# Altium schematic sheet RobotDriverSCH.SchDoc
size A3
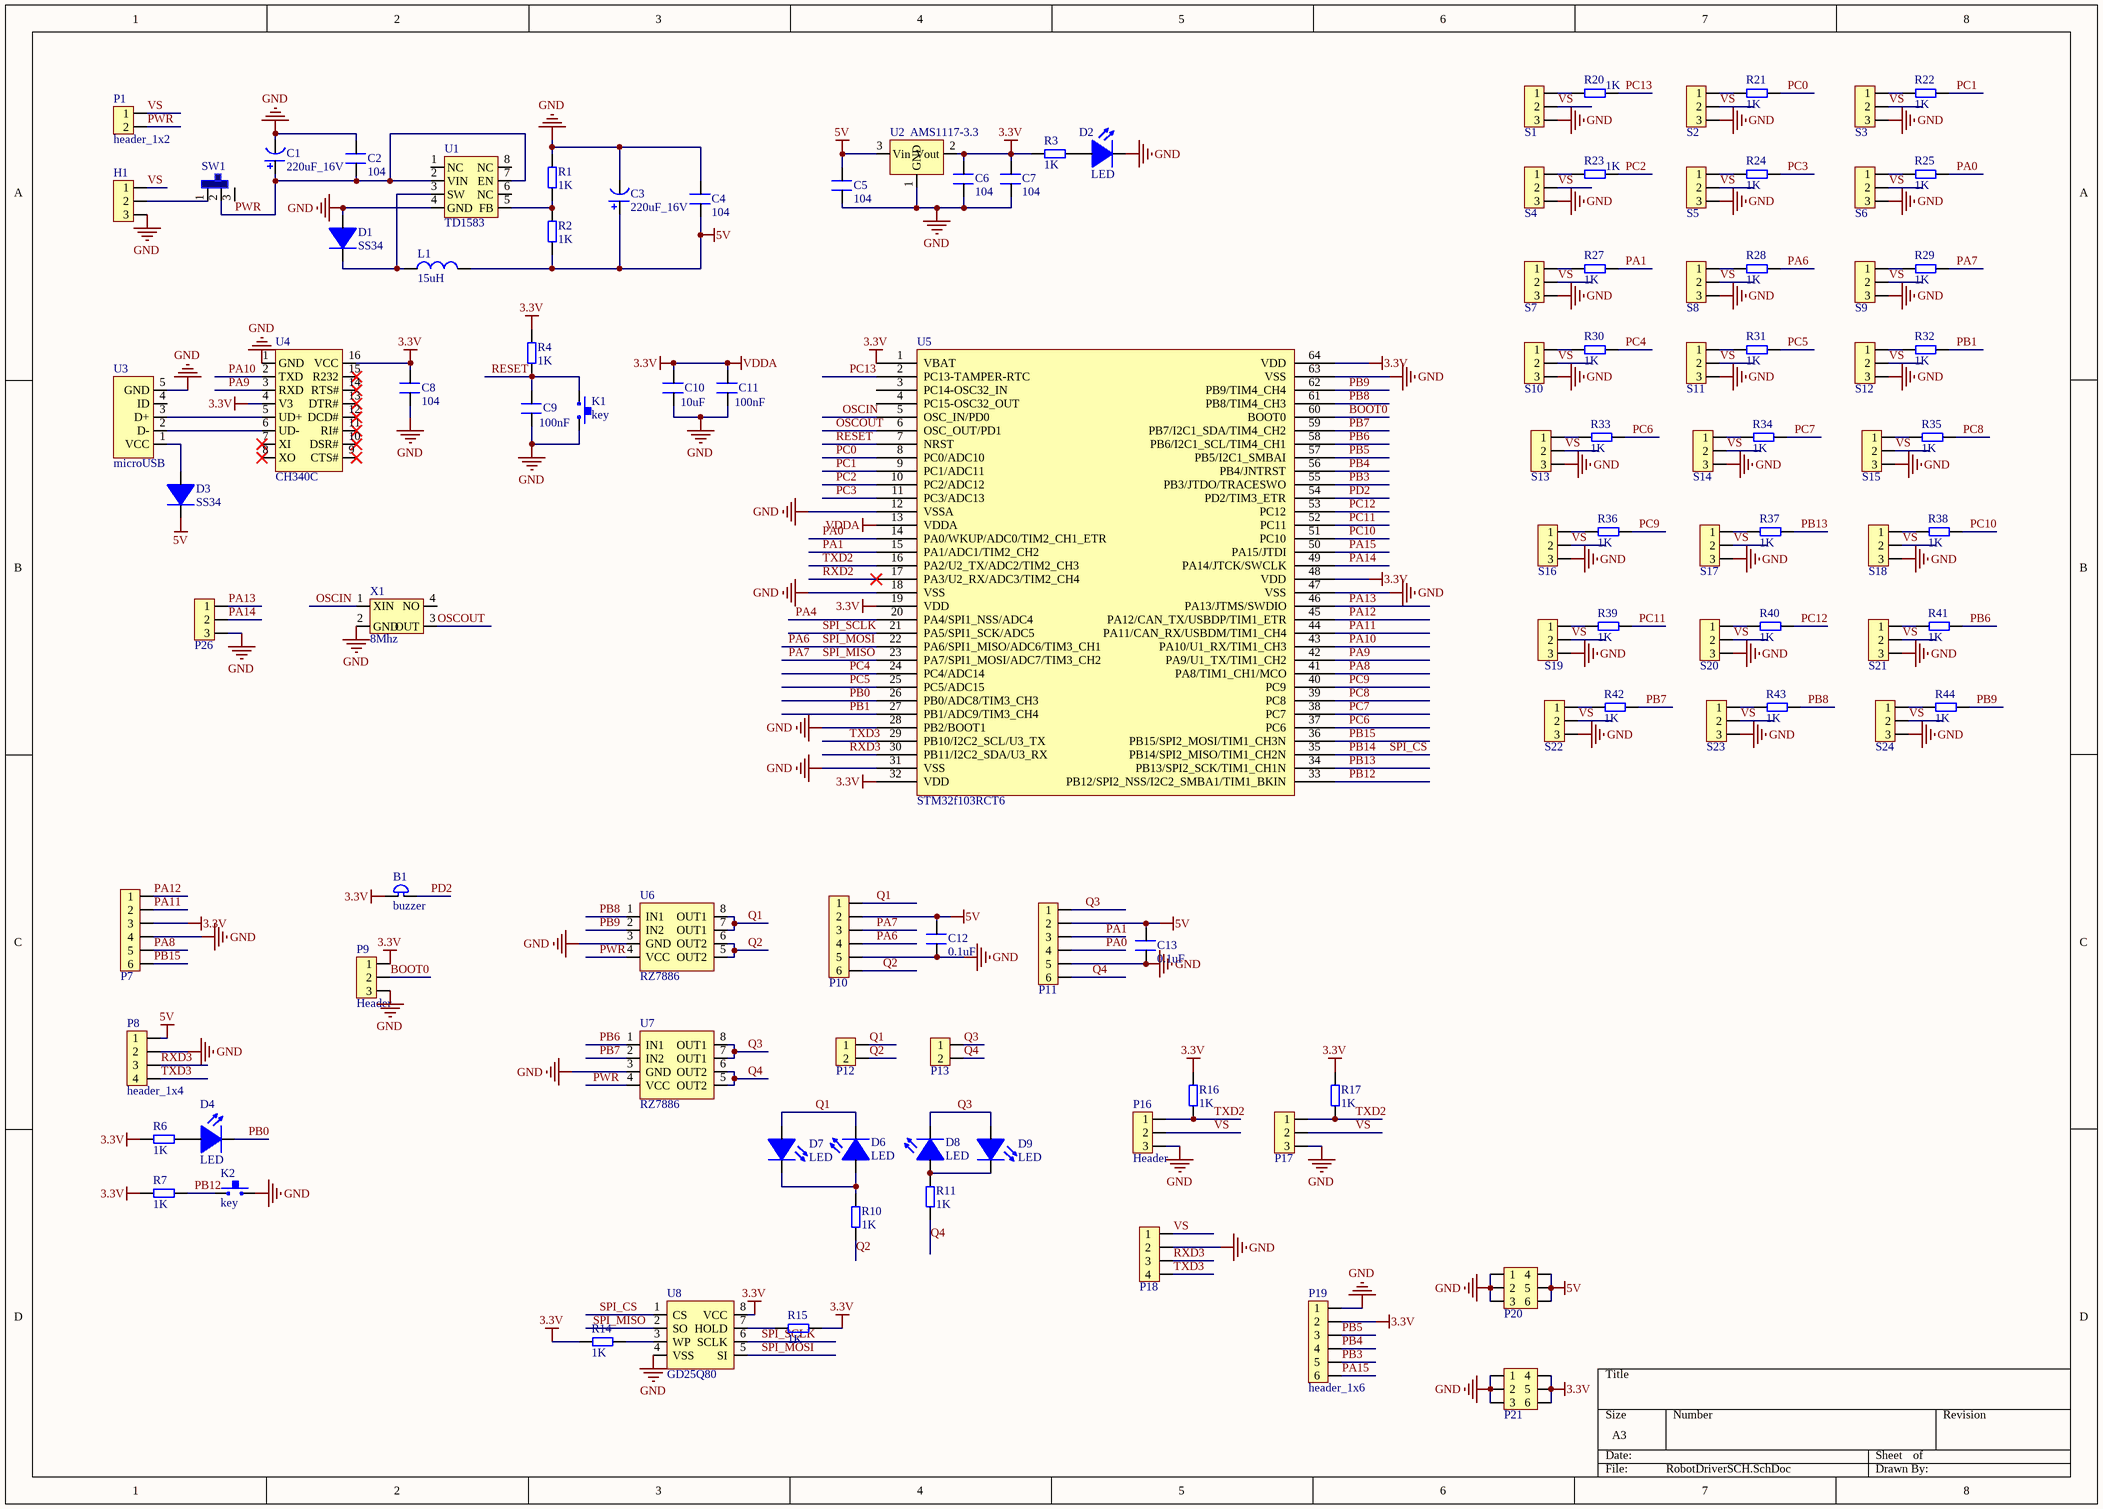
[diagram p0: RobotDriverSCH.SchDoc]

## Parts
B1  buzzer  [BEEP 5x9x5.5]
C1  220uF_16V  [CM D(6.3*7.7)]
C2  104  [C 0603]
C3  220uF_16V  [CM D(6.3*7.7)]
C4  104  [C 0603]
C5  104  [C 0603]
C6  104  [C 0603]
C7  104  [C 0603]
C8  104  [C 0603]
C9  100nF  [C 0603]
C10  10uF  [C 0603]
C11  100nF  [C 0603]
C12  0.1uF  [C 0603]
C13  0.1uF  [C 0603]
D1  SS34  [SMA]
D2  LED  [LED 0603R]
D3  SS34  [SMA]
D4  LED  [LED 0603R]
D6  LED  [LED 0603R]
D7  LED  [LED 0603R]
D8  LED  [LED 0603R]
D9  LED  [LED 0603R]
H1  header  [KF128-3.81-3P]  (value not drawn)
K1  key  [TSW SMD-3*6*4.3]
K2  key  [TSW SMD-3*6*4.3]
L1  15uH  [NR6045]
P1  header_1x2  [HDR2.54-LI-2P]
P7  PS2无线手柄  [XH2.54-LI-6P]  (value not drawn)
P8  header_1x4  [HDR2.54-LI-4P]
P9  Header  [HDR2.54-LI-3P]
P10  XH2.54W_1X6  [XH2.54-WI-6P]  (value not drawn)
P11  XH2.54W_1X6  [XH2.54-WI-6P]  (value not drawn)
P12  KF2.54_1x2  [KF2EDGK-2.54-WI-2P]  (value not drawn)
P13  KF2.54_1x2  [KF2EDGK-2.54-WI-2P]  (value not drawn)
P16  Header  [XH2.54-WI-3P]
P17  Header  [XH2.54-WI-3P]  (value not drawn)
P18  header_1x4  [XH2.54-WI-4P]  (value not drawn)
P19  header_1x6  [HDR2.54-M-LI-6P]
P20  Header2x3  [HDR2.54-LI-2x3P]  (value not drawn)
P21  Header2x3  [HDR2.54-LI-2x3P]  (value not drawn)
P26  Head_1x3  [HDR2.54-LI-3P]  (value not drawn)
R1  1K  [0603R]
R2  1K  [0603R]
R3  1K  [0603R]
R4  1K  [0603R]
R6  1K  [0603R]
R7  1K  [0603R]
R10  1K  [0603R]
R11  1K  [0603R]
R14  1K  [0603R]
R15  1K  [0603R]
R16  1K  [0603R]
R17  1K  [0603R]
R20  1K  [0603R]
R21  1K  [0603R]
R22  1K  [0603R]
R23  1K  [0603R]
R24  1K  [0603R]
R25  1K  [0603R]
R27  1K  [0603R]
R28  1K  [0603R]
R29  1K  [0603R]
R30  1K  [0603R]
R31  1K  [0603R]
R32  1K  [0603R]
R33  1K  [0603R]
R34  1K  [0603R]
R35  1K  [0603R]
R36  1K  [0603R]
R37  1K  [0603R]
R38  1K  [0603R]
R39  1K  [0603R]
R40  1K  [0603R]
R41  1K  [0603R]
R42  1K  [0603R]
R43  1K  [0603R]
R44  1K  [0603R]
S1  Header  [HDR2.54-LI-3P]  (value not drawn)
S2  Header  [HDR2.54-LI-3P]  (value not drawn)
S3  Header  [HDR2.54-LI-3P]  (value not drawn)
S4  Header  [HDR2.54-LI-3P]  (value not drawn)
S5  Header  [HDR2.54-LI-3P]  (value not drawn)
S6  Header  [HDR2.54-LI-3P]  (value not drawn)
S7  Header  [HDR2.54-LI-3P]  (value not drawn)
S8  Header  [HDR2.54-LI-3P]  (value not drawn)
S9  Header  [HDR2.54-LI-3P]  (value not drawn)
S10  Header  [HDR2.54-LI-3P]  (value not drawn)
S11  Header  [HDR2.54-LI-3P]  (value not drawn)
S12  Header  [HDR2.54-LI-3P]  (value not drawn)
S13  Header  [HDR2.54-LI-3P]  (value not drawn)
S14  Header  [HDR2.54-LI-3P]  (value not drawn)
S15  Header  [HDR2.54-LI-3P]  (value not drawn)
S16  Header  [HDR2.54-LI-3P]  (value not drawn)
S17  Header  [HDR2.54-LI-3P]  (value not drawn)
S18  Header  [HDR2.54-LI-3P]  (value not drawn)
S19  Header  [HDR2.54-LI-3P]  (value not drawn)
S20  Header  [HDR2.54-LI-3P]  (value not drawn)
S21  Header  [HDR2.54-LI-3P]  (value not drawn)
S22  Header  [HDR2.54-LI-3P]  (value not drawn)
S23  Header  [HDR2.54-LI-3P]  (value not drawn)
S24  Header  [HDR2.54-LI-3P]  (value not drawn)
SW1  Switch  [SS12D10]  (value not drawn)
U1  TD1583  [SOP8]
U2  AMS1117-3.3  [SOT-223]
U3  microUSB  [USB-MICRO_B]
U4  CH340C  [SOP16]
U5  STM32f103RCT6  [LQFP_64]
U6  RZ7886  [DIP8]
U7  RZ7886  [DIP8]
U8  GD25Q80  [SOP8]
X1  8Mhz  [OSC 3225-4P]

## Nets
3.3V: B1.1 C6.1 C7.1 C8.1 C10.1 C11.1 P7.3 P9.1 P19.2 P21.4 P21.5 P21.6 R3.1 R4.2 R6.1 R7.1 R14.1 R15.2 R16.2 R17.2 U2.2(Vout) U4.4(V3) U4.16(VCC) U5.1(VBAT) U5.13(VDDA) U5.19(VDD) U5.32(VDD) U5.48(VDD) U5.64(VDD) U8.8(VCC)  [also labelled VDDA]
5V: C3.1 C4.2 C5.1 C12.1 C13.1 D3.2 L1.2 P8.1 P10.2 P11.2 P20.4 P20.5 P20.6 R2.1 U2.3(Vin)
GND: C1.2 C2.1 C3.2 C4.1 C5.2 C6.2 C7.2 C8.2 C9.2 C10.2 C11.2 C12.2 C13.2 D1.1 D2.2 H1.3 K1.2 K2.2 P7.4 P8.2 P9.3 P10.5 P11.5 P16.3 P17.3 P18.2 P19.1 P20.1 P20.2 P20.3 P21.1 P21.2 P21.3 P26.3 R1.2 S1.3 S2.3 S3.3 S4.3 S5.3 S6.3 S7.3 S8.3 S9.3 S10.3 S11.3 S12.3 S13.3 S14.3 S15.3 S16.3 S17.3 S18.3 S19.3 S20.3 S21.3 S22.3 S23.3 S24.3 U1.4(GND) U2.1(GND) U3.5(GND) U4.1(GND) U5.12(VSSA) U5.18(VSS) U5.28(PB2/BOOT1) U5.31(VSS) U5.47(VSS) U5.63(VSS) U6.3(GND) U7.3(GND) U8.4(VSS) X1.2(GND)
BOOT0: P9.2 U5.60(BOOT0)
OSCIN: U5.5(OSC_IN/PD0) X1.1(XIN)
OSCOUT: U5.6(OSC_OUT/PD1) X1.3(OUT)
PA0: P11.4 R25.2 U5.14(PA0/WKUP/ADC0/TIM2_CH1_ETR)
PA1: P11.3 R27.2 U5.15(PA1/ADC1/TIM2_CH2)
PA4: U5.20(PA4/SPI1_NSS/ADC4)
PA6: P10.4 R28.2 U5.22(PA6/SPI1_MISO/ADC6/TIM3_CH1) U8.5(SI)  [also labelled SPI_MOSI]
PA7: P10.3 R29.2 U5.23(PA7/SPI1_MOSI/ADC7/TIM3_CH2) U8.2(SO)  [also labelled SPI_MISO]
PA8: P7.5 U5.41(PA8/TIM1_CH1/MCO)
PA9: U4.3(RXD) U5.42(PA9/U1_TX/TIM1_CH2)
PA10: U4.2(TXD) U5.43(PA10/U1_RX/TIM1_CH3)
PA11: P7.2 U5.44(PA11/CAN_RX/USBDM/TIM1_CH4)
PA12: P7.1 U5.45(PA12/CAN_TX/USBDP/TIM1_ETR)
PA13: P26.1 U5.46(PA13/JTMS/SWDIO)
PA14: P26.2 U5.49(PA14/JTCK/SWCLK)
PA15: P19.6 U5.50(PA15/JTDI)
PB0: D4.2 U5.26(PB0/ADC8/TIM3_CH3)
PB1: R32.2 U5.27(PB1/ADC9/TIM3_CH4)
PB3: P19.5 U5.55(PB3/JTDO/TRACESWO)
PB4: P19.4 U5.56(PB4/JNTRST)
PB5: P19.3 U5.57(PB5/I2C1_SMBAI)
PB6: R41.2 U5.58(PB6/I2C1_SCL/TIM4_CH1) U7.1(IN1)
PB7: R42.2 U5.59(PB7/I2C1_SDA/TIM4_CH2) U7.2(IN2)
PB8: R43.2 U5.61(PB8/TIM4_CH3) U6.1(IN1)
PB9: R44.2 U5.62(PB9/TIM4_CH4) U6.2(IN2)
PB12: K2.1 R7.2 U5.33(PB12/SPI2_NSS/I2C2_SMBA1/TIM1_BKIN)
PB13: R37.2 U5.34(PB13/SPI2_SCK/TIM1_CH1N)
PB14: U5.35(PB14/SPI2_MISO/TIM1_CH2N) U8.1(CS)  [also labelled SPI_CS]
PB15: P7.6 U5.36(PB15/SPI2_MOSI/TIM1_CH3N)
PC0: R21.2 U5.8(PC0/ADC10)
PC1: R22.2 U5.9(PC1/ADC11)
PC2: R23.2 U5.10(PC2/ADC12)
PC3: R24.2 U5.11(PC3/ADC13)
PC4: R30.2 U5.24(PC4/ADC14)
PC5: R31.2 U5.25(PC5/ADC15)
PC6: R33.2 U5.37(PC6)
PC7: R34.2 U5.38(PC7)
PC8: R35.2 U5.39(PC8)
PC9: R36.2 U5.40(PC9)
PC10: R38.2 U5.51(PC10)
PC11: R39.2 U5.52(PC11)
PC12: R40.2 U5.53(PC12)
PC13: R20.2 U5.2(PC13-TAMPER-RTC)
PD2: B1.2 U5.54(PD2/TIM3_ETR)
PWR: C1.1 C2.2 P1.2 SW1.2 U1.2(VIN) U1.7(EN) U6.4(VCC) U7.4(VCC)
Q1: D6.2 D7.1 P10.1 P12.1 U6.7(OUT1) U6.8(OUT1)
Q2: P10.6 P12.2 R10.1 U6.5(OUT2) U6.6(OUT2)
Q3: D8.2 D9.1 P11.1 P13.1 U7.7(OUT1) U7.8(OUT1)
Q4: P11.6 P13.2 R11.1 U7.5(OUT2) U7.6(OUT2)
RESET: C9.1 K1.1 R4.1 U5.7(NRST)
RXD2: U5.17(PA3/U2_RX/ADC3/TIM2_CH4)
RXD3: P8.3 P18.3 U5.30(PB11/I2C2_SDA/U3_RX)
SPI_SCLK: U5.21(PA5/SPI1_SCK/ADC5) U8.6(SCLK)
TXD2: P16.1 P17.1 R16.1 R17.1 U5.16(PA2/U2_TX/ADC2/TIM2_CH3)
TXD3: P8.4 P18.4 U5.29(PB10/I2C2_SCL/U3_TX)
VS: H1.1 P1.1 P16.2 P17.2 P18.1 S1.2 S2.2 S3.2 S4.2 S5.2 S6.2 S7.2 S8.2 S9.2 S10.2 S11.2 S12.2 S13.2 S14.2 S15.2 S16.2 S17.2 S18.2 S19.2 S20.2 S21.2 S22.2 S23.2 S24.2
NetD1_2: D1.2 L1.1 U1.3(SW)
NetD2_1: D2.1 R3.2
NetD3_1: D3.1 U3.1(VCC)
NetD4_1: D4.1 R6.2
NetD6_1: D6.1 D7.2 R10.2
NetD8_1: D8.1 D9.2 R11.2
NetH1_2: H1.2 SW1.1
NetR1_1: R1.1 R2.2 U1.5(FB)
NetR14_2: R14.2 U8.3(WP)
NetR15_1: R15.1 U8.7(HOLD)
NetR20_1: R20.1 S1.1
NetR21_1: R21.1 S2.1
NetR22_1: R22.1 S3.1
NetR23_1: R23.1 S4.1
NetR24_1: R24.1 S5.1
NetR25_1: R25.1 S6.1
NetR27_1: R27.1 S7.1
NetR28_1: R28.1 S8.1
NetR29_1: R29.1 S9.1
NetR30_1: R30.1 S10.1
NetR31_1: R31.1 S11.1
NetR32_1: R32.1 S12.1
NetR33_1: R33.1 S13.1
NetR34_1: R34.1 S14.1
NetR35_1: R35.1 S15.1
NetR36_1: R36.1 S16.1
NetR37_1: R37.1 S17.1
NetR38_1: R38.1 S18.1
NetR39_1: R39.1 S19.1
NetR40_1: R40.1 S20.1
NetR41_1: R41.1 S21.1
NetR42_1: R42.1 S22.1
NetR43_1: R43.1 S23.1
NetR44_1: R44.1 S24.1
NetU3_2: U3.2(D-) U4.6(UD-)
NetU3_3: U3.3(D+) U4.5(UD+)

Not connected (* = marked no-connect by the designer): SW1 3; U1 1(NC) 6(NC) 8(NC); U3 4(ID); U4 7(XI)* 8(XO)* 9(CTS#)* 10(DSR#)* 11(RI#)* 12(DCD#)* 13(DTR#)* 14(RTS#)* 15(R232)*; U5 3(PC14-OSC32_IN) 4(PC15-OSC32_OUT); X1 4(NO)

## Library data of the parts
C1 C3 = CAP_220uF_16V
C2 C4-C13 = C_0603
H1 = PowerHead
L1 = L_6045
P7 = xh2.54_1x6
P9 P16 P17 S1-S24 = header_1x3
R1-R4 R6 R7 R10 R11 R14-R17 R20-R25 R27-R44 = R_0603
SW1 = SS12D10
U3 = MicroUSB_B
U8 = flash
X1 = XTAL